# EAGLE design ch55xRebootTool (EAGLE 9.6.2)
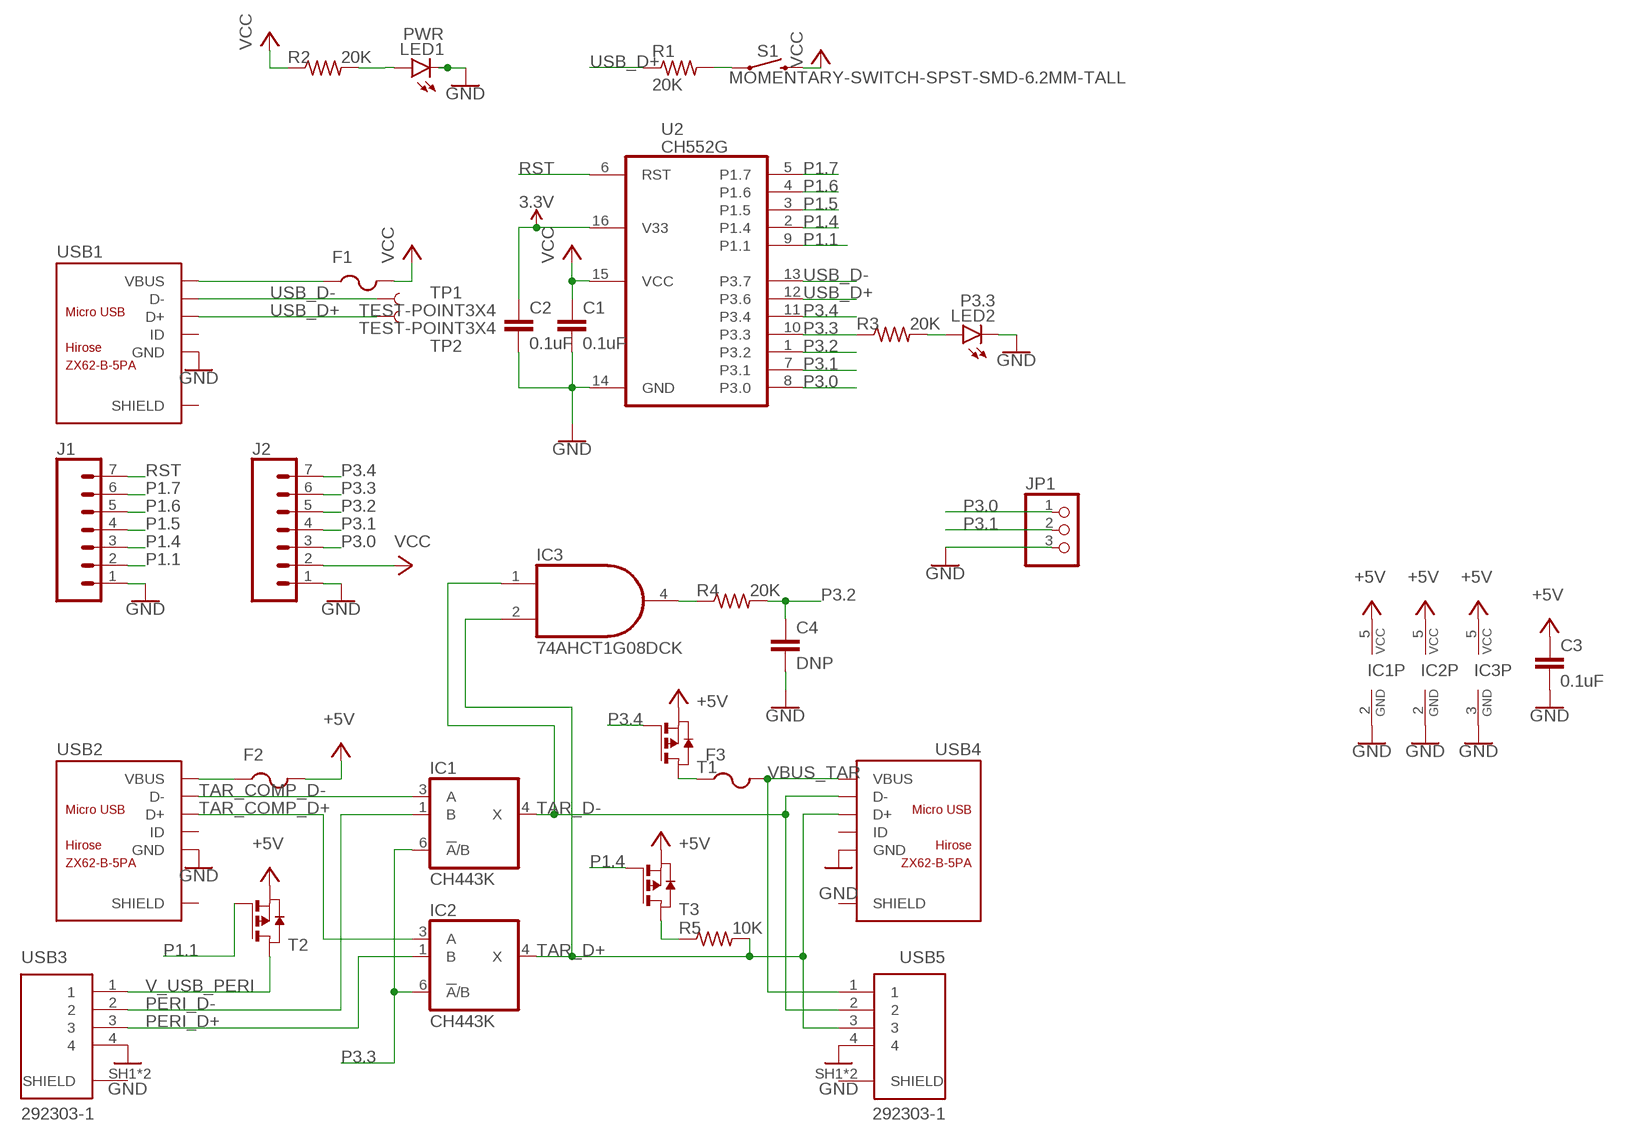
[diagram p0: schematic, sheet 1]

## Parts
C1  0.1uF  C-EUC0805K  [C0805K]
C2  0.1uF  C-EUC0805K  [C0805K]
C3  0.1uF  C-EUC0805K  [C0805K]
C4  DNP  C-EUC0805K  [C0805K]
F1  PTCFUSE-1206  [R1206]
F2  PTCFUSE-1206  [R1206]
F3  PTCFUSE-1206  [R1206]
IC1  CH443K  741G3157DCKR  [DCK_R-PDSO-G6]
IC2  CH443K  741G3157DCKR  [DCK_R-PDSO-G6]
IC3  74AHCT1G08DCK  [SC70-5]
J1  CONN_07NO_SILK  [1X07_NO_SILK]
J2  CONN_07NO_SILK  [1X07_NO_SILK]
JP1  PINHD-1X3  [1X03]
LED1  PWR  GHI-BASICCOMPONENTS_LED-(INCH)-0805  [GHI-BASICCOMPONENTS_0805-LED]
LED2  P3.3  GHI-BASICCOMPONENTS_LED-(INCH)-0805  [GHI-BASICCOMPONENTS_0805-LED]
R1  20K  R-US_R0805  [R0805]
R2  20K  R-US_R0805  [R0805]
R3  20K  R-US_R0805  [R0805]
R4  20K  R-US_R0805  [R0805]
R5  10K  R-US_R0805  [R0805]
S1  MOMENTARY-SWITCH-SPST-SMD-6.2MM-TALL  [TACTILE_SWITCH_SMD_6.2MM_TALL]
T1  PMOSSOT23  [SOT-23]
T2  PMOSSOT23  [SOT-23]
T3  PMOSSOT23  [SOT-23]
TP1  TEST-POINT3X4  [PAD.03X.04]
TP2  TEST-POINT3X4  [PAD.03X.04]
U2  CH552G  MY_IC_CH551G_CH552GSOP-16  [MY_IC_SO16]
USB1  ZX62-B-5PA  MICRO-USB-SMD(ZX62-B-5PA)  [MICRO-USB5+6P-SMD-0.65-AB]
USB2  ZX62-B-5PA  MICRO-USB-SMD(ZX62-B-5PA)  [MICRO-USB5+6P-SMD-0.65-AB]
USB3  292303-1  [292303-1]
USB4  ZX62-B-5PA  MICRO-USB-SMD(ZX62-B-5PA)  [MICRO-USB5+6P-SMD-0.65-AB]
USB5  292303-1  [292303-1]

## Nets
3.3V: C2.1 U2.16(V33)
+5V: C3.1 F2.2 IC1.5(VCC) IC2.5(VCC) IC3.5(VCC) T1.2(S) T2.2(S) T3.2(S)
GND: C1.2 C2.2 C3.2 C4.2 IC1.2(GND) IC2.2(GND) IC3.3(GND) J1.1 J2.1 JP1.3 LED1.K LED2.K U2.14(GND) USB1.5(GND) USB2.5(GND) USB3.4 USB4.5(GND) USB5.4
N$1: R1.2 S1.A2
N$2: LED2.A R3.2
N$3: LED1.A R2.2
N$4: IC3.4(O) R4.1
N$5: F3.1 T1.1(D)
N$7: R5.1 T3.1(D)
P1.1: J1.2 T2.3(G) U2.9(P1.1)
P1.4: J1.3 T3.3(G) U2.2(P1.4)
P1.5: J1.4 U2.3(P1.5)
P1.6: J1.5 U2.4(P1.6)
P1.7: J1.6 U2.5(P1.7)
P3.0: J2.3 JP1.1 U2.8(P3.0)
P3.1: J2.4 JP1.2 U2.7(P3.1)
P3.2: C4.1 J2.5 R4.2 U2.1(P3.2)
P3.3: IC1.6(!A!/B) IC2.6(!A!/B) J2.6 R3.1 U2.10(P3.3)
P3.4: J2.7 T1.3(G) U2.11(P3.4)
PERI_D+: IC2.1(B) USB3.3
PERI_D-: IC1.1(B) USB3.2
RST: J1.7 U2.6(RST)
TAR_COMP_D+: IC2.3(A) USB2.3(D+)
TAR_COMP_D-: IC1.3(A) USB2.2(D-)
TAR_D+: IC2.4(X) IC3.2(I1) R5.2 USB4.3(D+) USB5.3
TAR_D-: IC1.4(X) IC3.1(I0) USB4.2(D-) USB5.2
USB_D+: R1.1 TP2.P$1 U2.12(P3.6) USB1.3(D+)
USB_D-: TP1.P$1 U2.13(P3.7) USB1.2(D-)
V_USB_PERI: T2.1(D) USB3.1
VBUS: F1.1 USB1.1(VBUS)
VBUS_COMP: F2.1 USB2.1(VBUS)
VBUS_TAR: F3.2 USB4.1(VBUS) USB5.1
VCC: C1.1 F1.2 J2.2 R2.1 S1.B2 U2.15(VCC)
Unconnected: USB1.4(ID) USB1.P1(SHIELD) USB1.P2(SHIELD) USB1.P3(SHIELD) USB1.P4(SHIELD) USB1.P5(SHIELD) USB1.P6(SHIELD) USB2.4(ID) USB2.P1(SHIELD) USB2.P2(SHIELD) USB2.P3(SHIELD) USB2.P4(SHIELD) USB2.P5(SHIELD) USB2.P6(SHIELD) USB4.4(ID) USB4.P1(SHIELD) USB4.P2(SHIELD) USB4.P3(SHIELD) USB4.P4(SHIELD) USB4.P5(SHIELD) USB4.P6(SHIELD)

## Power pins joined to a net without a drawn wire
SHIELD: USB3.SH1(SHIELD) USB3.SH2(SHIELD) USB5.SH1(SHIELD) USB5.SH2(SHIELD)

## Library data of the parts
C1-C3 = rcl:C-EU: CAPACITOR, European symbol; LCSC: C16834; SPICEPREFIX: C
C4 = rcl:C-EU: CAPACITOR, European symbol; SPICEPREFIX: C
F1-F3 = adafruit:PTCFUSE: PTC fuses, resettable thermistors; LCSC: C151162
IC1 IC2 = 74xx-little-de:74*1G3157: Single-Pole, Double-Throw Analog Switch Source: http://focus.ti.com/lit/ds/symlink/sn74lvc1g3157.pdf; LCSC: C125185
IC3 = 74xx-little-us:74*1G08: 2-input AND gate; LCSC: C12493
J1 J2 = SparkFun-Connectors:CONN_07: Multi connection point. Often used as Generic Header-pin footprint for 0.1 inch spaced/style header connections On any of the 0.1 inch spaced packages, you can populate with these: Break Away Headers - Straight <https://www.sparkfun.com/products/116> (PRT-00116) Break Away Male Headers - Right Angle <https://www.sparkfun.com/products/553> (PRT-00553) Female Headers <https://www.sparkfun.com/products/115> (PRT-00115) Break Away Headers - Machine Pin <https://www.sparkfun.com/products/117> (PRT-00117) Break Away Female Headers - Swiss Machine Pin <https://www.sparkfun.com/products/743> (PRT-00743) For SCREWTERMINALS and SPRING TERMINALS visit here: Screw Terimnals on SparkFun.com <https://www.sparkfun.com/search/results?term=Screw+Terminals> (5mm/3.5mm/2.54mm spacing) This device is also useful as a general connection point to wire up your design to another part of your project. Our various solder wires solder well into these plated through hole pads. Hook-Up Wire - Assortment (Stranded, 22 AWG) <https://www.sparkfun.com/products/11375> (PRT-11375) Hook-Up Wire - Assortment (Solid Core, 22 AWG) <https://www.sparkfun.com/products/11367> (PRT-11367) View the entire wire category on our website here <https://www.sparkfun.com/categories/141> Special notes: Molex polarized connector foot print use with SKU : PRT-08231 with associated crimp pins and housings. 1MM SMD Version SKU: PRT-10208 NOTES ON THE VARIANTS LOCK and LOCK_LONGPADS... This footprint was designed to help hold the alignment of a through-hole component (i.e. 6-pin header) while soldering it into place. You may notice that each hole has been shifted either up or down by 0.005 of an inch from it's more standard position (which is a perfectly straight line). This slight alteration caused the pins (the squares in the middle) to touch the edges of the holes. Because they are alternating, it causes a "brace" to hold the component in place. 0.005 has proven to be the perfect amount of "off-center" position when using our standard breakaway headers. Although looks a little odd when you look at the bare footprint, once you have a header in there, the alteration is very hard to notice. Also,if you push a header all the way into place, it is covered up entirely on the bottom side.
JP1 = pinhead:PINHD-1X3: PIN HEADER
LED1 LED2 = BeagleBone_Black_Wireless:GHI-BASICCOMPONENTS_LED-(INCH)-
R1-R5 = rcl:R-US_: RESISTOR, American symbol; SPICEPREFIX: R
S1 = SparkFun-Switches:MOMENTARY-SWITCH-SPST: Momentary Switch (Pushbutton) - SPST Normally-open (NO) SPST momentary switches (buttons, pushbuttons). Variants PTH-12MM - 12mm square, through-hole Momentary Pushbutton Switch - 12mm Square <https://www.sparkfun.com/products/9190> (COM-09190) PTH-6.0MM, PTH-6.0MM-KIT - 6.0mm square, through-hole Mini Pushbutton Switch <https://www.sparkfun.com/products/97> (COM-00097) KIT package intended for soldering kit's - only one side of pads' copper is exposed. PTH-RIGHT-ANGLE-KIT - Right-angle, through-hole Right Angle Tactile Button <https://www.sparkfun.com/products/10791> - Used on SparkFun BigTime Watch Kit <https://www.sparkfun.com/products/11734> SMD-12MM - 12mm square, surface-mount Tactile Button - SMD (12mm) <https://www.sparkfun.com/products/12993> (COM-12993) Used on SparkFun PicoBoard <https://www.sparkfun.com/products/11888> SMD-4.5MM - 4.5mm Square Trackball Switch Used on SparkFun Blackberry Trackballer Breakout <https://www.sparkfun.com/products/13169> SMD-4.6MMX2.8MM - 4.60mm x 2.80mm, surface mount Used on SparkFun SAMD21 Mini Breakout <https://www.sparkfun.com/products/13664> SMD-5.2MM, SMD-5.2-REDUNDANT - 5.2mm square, surface-mount Mini Pushbutton Switch - SMD <https://www.sparkfun.com/products/8720> (COM-08720) Used on Arduino Pro Mini <https://www.sparkfun.com/products/11114> REDUNDANT package connects both switch circuits together SMD-6.0X3.5MM - 6.0 x 3.5mm, surface mount Momentary Reset Switch SMD <https://www.sparkfun.com/products/8229> (COM-08229) SMD-6.2MM-TALL - 6.2mm square, surface mount Tactile Button - SMD (6mm) <https://www.sparkfun.com/products/12992> Used on SparkFun Digital Sandbox <https://www.sparkfun.com/products/12651> SMD-RIGHT-ANGLE - Right-angle, surface mount Used on SparkFun Block for Intel® Edison - Arduino <https://www.sparkfun.com/products/13036>; PROD_ID: SWCH-11966; SF_SKU: COM-12992
T1-T3 = zetex:PMOSSOT23: MOS FET; OC_FARNELL: unknown; OC_NEWARK: unknown
TP1 TP2 = SparkFun-Connectors:TEST-POINT: SparkFun Test Points Bare copper test points for troubleshooting or In-Circuit-Testing. These are used by our Production team for verifying production board runs using pogo-pins on test beds. SparkFun Products: SparkFun LSM9DS1 Breakout <https://www.sparkfun.com/products/13284> SparkFun PSOC <https://www.sparkfun.com/products/13714> SparkFun Load Cell Amplifier <https://www.sparkfun.com/products/13879>
U2 = myOwnLib:MY_IC_CH551G_CH552G; LCSC: C111292
USB1 USB2 USB4 = microusbConnector:MICRO-USB-SMD(ZX62-B-5PA): 320010005; LCSC: C10418; MPN: ZX62-B-5PA
USB3 USB5 = USB connector:292303-1: CONN RCPT USB2.0 TYPEA 4POS R/A Manufacturer's datasheet <https://www.te.com/commerce/DocumentDelivery/DDEController?Action=srchrtrv&DocNm=292303&DocType=Customer+Drawing&DocLang=English>; CREATED_BY: PCBLayout.com; DIGIKEY_PARTNO: A31726-ND; LCSC: C2345; MANUFACTURER: TE Connectivity AMP Connectors; MPN: 292303-1

## Board
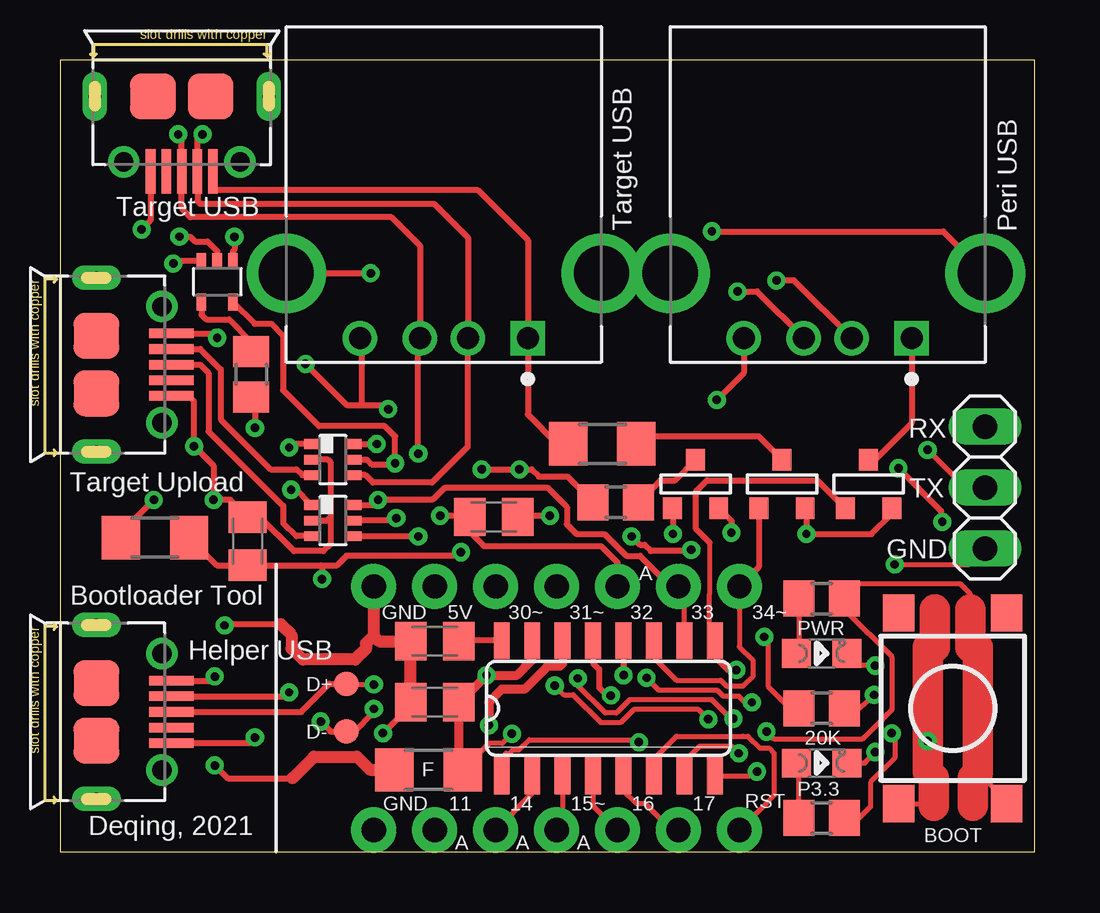
[diagram p1: board, top side]
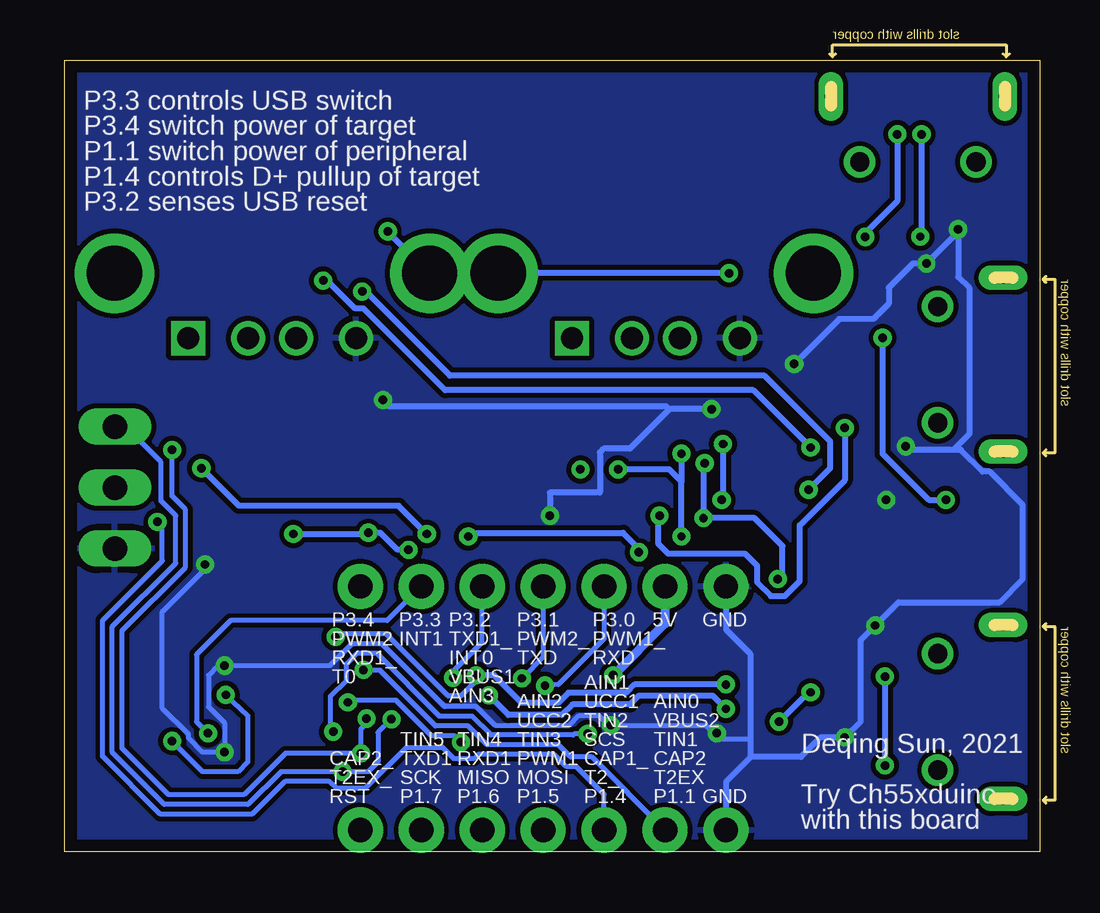
[diagram p2: board, bottom side, seen from below]

Size 40.64 x 33.02 mm. Coordinates in mm from the lower left corner, seen from the top.
Outline: 0,0 40.64,0 40.64,33.02 0,33.02 0,0
Copper layers (1*16): Top 0.035mm / dielectric 1.5mm / Bottom 0.035mm
Design rules "eagleRules10Mil *": minimum track width 8mil, minimum drill 0.3mm, track to track 8mil, track to pad 8mil, pad to pad 8mil, via to via 8mil, smd to smd 8mil, copper to edge 20mil, drill to drill 20mil, minimum pad ring 10mil, minimum via ring 8mil, stop-mask expansion 4mil, vias tented up to drill 14mil, thermal gap 10mil

### Footprints (pad centres in the part's own frame; a part is rotated, then mirrored left to right if it is on the bottom)
C0805K = smd 1.3 x 1.6: 1 -1,0; 2 1,0
R1206 = smd 1.6 x 1.803: 1 -1.422,0; 2 1.422,0
DCK_R-PDSO-G6 = smd 0.4 x 0.7: 1 -0.65,-0.85; 2 0,-0.85; 3 0.65,-0.85; 4 0.65,0.85; 5 0,0.85; 6 -0.65,0.85
SC70-5 = smd 0.4 x 0.7: 1 -0.65,-0.85; 2 0,-0.85; 3 0.65,-0.85; 4 0.65,0.85; 5 -0.65,0.85
1X07_NO_SILK = drill 1.016 pad 1.88: 1 0,0; 2 2.54,0; 3 5.08,0; 4 7.62,0; 5 10.16,0; 6 12.7,0; 7 15.24,0
1X03 = drill 1.016 long: 1 -2.54,0; 2 0,0; 3 2.54,0
GHI-BASICCOMPONENTS_0805-LED = smd 1.2 x 1.2: A 0,1.05; K 0,-1.05
R0805 = smd 1.3 x 1.5: 1 -0.95,0; 2 0.95,0
TACTILE_SWITCH_SMD_6.2MM_TALL = smd 1.55 x 1.3: A1 -3.975,-2.25; A2 3.975,-2.25; B1 -3.975,2.25; B2 3.975,2.25
SOT-23 = smd 0.787 x 0.889: 1 0.025,-1.016; 2 -0.94,1.016; 3 0.991,1.016
PAD.03X.04 = smd 1.016 x 1.016: P$1 0,0
MY_IC_SO16 = smd 0.66 x 1.524: 1 -4.445,-2.819; 2 -3.175,-2.819; 3 -1.905,-2.819; 4 -0.635,-2.819; 5 0.635,-2.819; 6 1.905,-2.819; 7 3.175,-2.819; 8 4.445,-2.819; 9 4.445,2.819; 10 3.175,2.819; 11 1.905,2.819; 12 0.635,2.819; 13 -0.635,2.819; 14 -1.905,2.819; 15 -3.175,2.819; 16 -4.445,2.819
MICRO-USB5+6P-SMD-0.65-AB = smd 0.4 x 1.858: 1 -1.3,3.129; 2 -0.65,3.129; 3 0,3.129; 4 0.65,3.129; 5 1.3,3.129 | smd 1.9 x 1.9: P1 -1.2,0; P2 1.2,0 | drill 0.508 pad 1.016 long: P3 -3.625,0; P4 3.625,0 | drill 0.8: P5 -2.425,2.73; P6 2.425,2.73
292303-1 = drill 0.92 square: 1 -3.5,2.71 | drill 0.92: 2 -1,2.71; 3 1,2.71; 4 3.5,2.71 | drill 2.3: SH1 -6.57,0; SH2 6.57,0

### Placement (x,y rotation side)
C1  15.62,6.25 180 top
C2  15.62,8.79 180 top
C3  7.82,12.95 90 top
C4  18.08,13.97 0 top
F1  15.37,3.43 0 top
F2  3.96,13.11 0 top
F3  22.61,17.02 180 top
IC1  11.38,16.36 270 top
IC2  11.38,13.82 270 top
IC3  6.55,23.77 180 top
J1  13.08,0.91 0 top
J2  13.08,11.07 0 top
JP1  38.56,15.19 270 top
LED1  31.75,8.28 90 top
LED2  31.75,3.71 90 top
R1  31.75,5.99 0 top
R2  31.75,10.57 180 top
R3  31.75,1.42 180 top
R4  7.98,19.91 270 top
R5  23.16,14.58 180 top
S1  37.21,5.99 270 top
T1  30.12,15.34 180 top
T2  33.73,15.34 180 top
T3  26.52,15.34 180 top
TP1  11.94,5.03 0 top
TP2  11.94,7.01 0 top
U2  22.86,5.99 0 top
USB1  1.52,5.84 270 top
USB2  1.52,20.32 270 top
USB3  32,24.13 180 top
USB4  5.08,31.5 180 top
USB5  16,24.13 180 top

### Tracks (layer width: path | path; a pad name or v marks a point on that pad's centre or on a via)
3.3V
  Top 0.254: U2.16 16.65,8.81 C2.1
+5V  (via drill 0.35)
  Top 0.254: v14.02,13.92 13.92,13.82 IC2.5 | IC3.5 8.11,22.02 8.81,22.02 9.3,21.54 9.3,19.25 10.79,17.75 13.54,17.75 13.97,17.32 v13.97,16.2 13.93,16.16 12.99,16.16 12.8,16.36 IC1.5 | F2.2 6.54,11.95 C3.1 10.87,11.95 | 10.87,11.95 11.55,11.95 11.94,12.34 16.56,12.34 v16.71,12.5 | 10.87,11.95 10.92,11.9 v10.92,11.38 | T1.2 31.11,14.28 v31.11,13.26 33.83,13.26 34.67,14.1 T2.2 | T3.2 27.99,13.79 v27.99,13.31 | v23.82,13.16 24.18,12.8 24.37,12.8 24.63,12.54 26.26,12.54 v26.31,12.6
  Bottom 0.254: v13.97,16.2 14.02,16.15 v14.02,13.92 11.89,13.92 10.72,12.75 10.72,11.58 v10.92,11.38 | v31.11,13.26 28.04,13.26 v27.99,13.31 27.48,13.31 26.77,12.6 v26.31,12.6 | v23.82,13.16 23.67,13.31 17.37,13.31 16.76,12.7 16.76,12.5 v16.71,12.5
GND  (via drill 0.35)
  Top 0.203: v33.98,7.77 33.31,7.77 LED1.K | LED2.K 33.56,3.71 33.98,4.13 v33.98,4.17 | v34.8,11.99 37.9,11.99 JP1.3
  Top 0.254: C1.2 14.62,6.11 v13.46,4.95 | USB1.5 7.89,4.54 v8.13,4.78 | IC2.2 11.12,13.82 11.28,13.97 | 11.28,13.97 11.28,16.26 11.18,16.36 IC1.2 | USB4.5 3.78,26.34 v3.4,25.96 | USB2.5 5.36,19.02 5.59,18.8 v5.59,16.92 6.4,16.1 v6.4,14.68 7.1,14.68 C3.2 8.35,13.95 9.75,12.55 10.97,12.55 11.28,12.85 11.28,13.97 | C4.2 19.14,14.02 v20.42,14.02 | v10.24,20.34 11.94,18.64 12.6,18.64 | v13.68,18.46 13.5,18.64 12.6,18.64 | v4.72,24.54 4.81,24.62 IC3.3 | 9.2,9.49 6.9,9.49 v6.86,9.45 | USB3.4 28.5,19.97 v27.38,18.85 | USB5.4 12.6,21.32 12.6,18.64
  Top 0.381: v17.88,5.28 17.88,6.25 18.41,6.78 19.36,6.78 20.32,7.75 20.83,7.75 20.95,7.87 U2.14
  Top 0.508: C1.2 C2.2 13.31,8.79 13.08,9.02 | J2.1 13.08,9.02 | 13.08,9.02 12.76,8.69 12.76,8.47 12.31,8.02 10.12,8.02 9.65,8.48 9.65,9.04 9.2,9.49
  Bottom 0.203: 12.06,4.7 13.34,4.7 13.92,5.28 v17.88,5.28 17.98,5.28 18.39,5.69 19.2,5.69 19.61,5.28 22.71,5.28 23.5,6.07 24.81,6.07 27.41,8.68 28.68,8.68 29.59,7.77 v33.98,7.77 34.24,7.77 34.65,7.37 34.65,6.04 33.98,5.38 v33.98,4.17 34.9,4.17 35.49,4.75 35.49,4.91 36.58,6 36.58,10.01 34.75,11.84 34.75,11.99 v34.8,11.99
  Bottom 0.254: J2.1 13.08,9.27 12.06,8.26 12.06,4.7 12.06,3.96 | J1.1 13.08,2.92 12.06,3.94 12.06,3.96 | 12.06,3.96 9.96,3.96 9.14,4.78 v8.13,4.78 7.47,5.44 7.47,8.84 v6.86,9.45 5.89,10.41 1.68,10.41 0.71,11.38 0.71,14.48 2.09,15.86 2.38,15.86 3.29,16.76 3.61,16.76 | 3.61,16.76 2.95,17.42 2.95,23.52 3.4,23.98 v3.4,25.96 3.4,25.86 v4.72,24.54 5.28,24.54 6.3,23.52 6.3,22.86 6.93,22.23 8.36,22.23 v10.24,20.34 | v13.68,18.46 15.44,18.46 | v20.42,14.02 20.42,14.99 18.34,14.99 18.34,16.66 18.19,16.82 17.09,16.82 15.44,18.46 | 15.44,18.46 15.57,18.59 27.13,18.59 v27.38,18.85 | v5.59,16.92 5.44,16.76 3.61,16.76
  pour Bottom: 0,0 40.64,0 40.64,33.02 0,33.02
N$1  (via drill 0.35)
  Top 0.203: R1.2 33.33,5.99 v33.93,6.55 | 36.17,8.53 36.47,8.53 | 36.17,3.34 36.42,3.08 | S1.A2 36.34,2.02 36.42,1.93
  Top 1.27: 36.17,8.53 v36.17,4.62 36.17,3.34 | 36.47,8.53 36.47,10.11 | 36.42,1.93 36.42,3.08
  Bottom 0.203: v33.93,6.55 33.02,5.69 33.02,3.76 33.43,3.35 34.9,3.35 v36.17,4.62
N$2
  Top 0.203: R3.2 30.8,3.61 LED2.A
N$3
  Top 0.203: R2.2 30.8,8.38 LED1.A
N$4
  Top 0.254: IC3.4 5.9,22.39 6.1,22.2 7.05,22.2 7.98,21.27 R4.1
N$5
  Top 0.254: F3.1 24.33,17.32 29.13,17.32 T1.1
N$7
  Top 0.254: R5.1 25.03,15.49 25.63,15.49 T3.1
P1.1  (via drill 0.35)
  Top 0.203: v28.19,7.59 27.82,7.59 27.28,8.13 27.28,8.79 U2.9 27.08,9.04 27.08,10.77 27.08,12.9
  Top 0.254: T2.3 31.57,15.49 26.98,15.49 26.52,15.04 26.52,13.46 27.08,12.9
  Bottom 0.203: J1.2 18.67,3.96 19.56,3.96 20.07,4.47 23.04,4.47 23.83,5.26 25.19,5.26 27.52,7.59 v28.19,7.59
P1.4  (via drill 0.35)
  Top 0.203: U2.2 19.68,2.44 J1.3 | v36.78,13.77 36.73,13.72
  Top 0.254: T3.3 25.55,14.3 v25.55,13.26 | v34.95,16 36.73,14.22 36.73,13.72
  Bottom 0.203: J1.3 18.16,2.41 19.3,3.56 19.73,3.56 20.23,4.06 23.42,4.06 23.59,3.89 24.41,3.89 24.89,4.37 26.4,4.37 28.1,2.67 29.34,2.67 29.62,2.95 31.46,2.95 32.84,1.57 36.66,1.57 39.06,3.98 39.06,9.65 36.58,12.14 36.58,13.56 v36.78,13.77
  Bottom 0.254: v25.55,13.26 26.72,14.43 33.38,14.43 v34.95,16
P1.5
  Top 0.203: U2.3 20.95,1.17 J1.4
P1.6
  Top 0.203: U2.4 22.23,1.93 J1.5
P1.7
  Top 0.203: U2.5 23.5,2.54 24,2.03 24.38,2.03 25.32,1.09 25.6,1.09 J1.6
P3.0  (via drill 0.35)
  Top 0.203: v20.62,6.93 21.01,6.55 21.4,6.55 22.56,5.38 23.36,5.38 23.92,5.94 26.62,5.94 v27.03,5.54 | U2.8 28.88,3.17 v29.06,3.35
  Bottom 0.203: J2.3 18.16,8.89 20.07,6.99 v20.62,6.93 | v27.03,5.54 27.58,4.98 27.58,3.76 27.99,3.35 v29.06,3.35 31.63,3.35 33,1.98 36.49,1.98 38.66,4.15 38.66,9.4 36.02,12.04 36.02,14.02 36.63,14.63 36.63,16.26 38.1,17.73 JP1.1
P3.1  (via drill 0.35)
  Top 0.203: v21.59,7.24 21.59,6.93 22.73,5.79 23.19,5.79 23.75,6.35 27.18,6.35 27.97,5.56 v28.07,5.56 | U2.7 26.04,3.79 26.67,4.42 27.99,4.42 v28.3,4.12 | v36.17,16.76 37.74,15.19 JP1.2
  Bottom 0.203: J2.4 20.7,8.13 v21.59,7.24 | v28.07,5.56 28.07,5.36 28.3,5.13 v28.3,4.12 31.45,4.12 33.17,2.39 36.32,2.39 38.25,4.32 38.25,9.23 35.61,11.87 35.61,12.8 35.61,14.28 36.17,14.83 v36.17,16.76
P3.2  (via drill 0.35)
  Top 0.203: U2.1 18.41,3.94 18.59,4.12 18.75,4.12 18.89,4.25 19.12,4.25 19.56,4.68 24.02,4.68 v24.13,4.58 | v24.45,7.26 24.96,6.76 27.38,6.76 27.64,6.5 28.29,6.5 28.55,6.24 v28.85,6.24
  Top 0.254: R4.2 8.13,18.81 v8.13,17.68 | v15.85,14.02 17.03,14.02 C4.1 17.09,13.34 17.68,12.75 22.55,12.75 23.24,12.06 J2.5
  Bottom 0.203: J2.5 23.24,8.74 24.45,7.52 v24.45,7.26 | v24.13,4.58 24.41,4.85 25.36,4.85 26.85,6.34 28.74,6.34 v28.85,6.24
  Bottom 0.254: v8.13,17.68 8.13,15.49 10.01,13.61 10.01,11.29 10.63,10.67 11.21,10.67 11.79,11.24 11.79,11.94 12.29,12.45 15.49,12.45 15.9,12.85 15.9,13.97 v15.85,14.02
P3.3  (via drill 0.35)
  Top 0.203: U2.10 26.04,10.82 J2.6 | v34.67,4.95 34.8,4.83 34.8,3.91 33.78,2.9 33.78,1.88 33.33,1.42 R3.1
  Top 0.254: IC2.6 13.04,14.47 v13.26,14.68 15.51,14.68 15.56,14.73 15.59,14.73 16.05,15.19 20.32,15.19 21.13,14.38 21.13,13.66 21.54,13.26 22.69,13.26 23.61,12.34 24.18,12.34 25.45,11.07 J2.6 | IC1.6 v13.2,17.01
  Bottom 0.203: J2.6 27.2,9.65 33.73,9.65 35.15,8.23 35.15,5.43 v34.67,4.95
  Bottom 0.254: v13.2,17.01 13.2,14.74 v13.26,14.68
P3.4
  Top 0.203: U2.11 24.77,8.1 25.7,7.16 27.55,7.16 27.8,6.91 27.91,6.91 28.48,6.91 28.88,7.31 28.88,8 28.32,8.56 J2.7
  Top 0.254: J2.7 29.13,11.89 T1.3
PERI_D+  (via drill 0.35)
  Top 0.254: IC2.1 10.48,14.47 9.79,15.15 9.69,15.15 v9.64,15.1 | v28.25,23.37 29.06,23.37 USB3.3
  Bottom 0.254: v9.64,15.1 8.74,16 8.74,17.12 11.48,19.86 24.59,19.86 28.09,23.37 v28.25,23.37
PERI_D-  (via drill 0.35)
  Top 0.254: IC1.1 9.69,17.01 v9.55,16.87 | USB3.2 30.6,23.82 v29.87,23.82
  Bottom 0.254: v9.55,16.87 11.94,19.25 24.79,19.25 28.2,22.66 28.54,22.66 29.7,23.82 v29.87,23.82
RST
  Top 0.203: U2.6 24.77,3.89 25.7,4.83 28.45,4.83 28.68,4.83 29.17,4.33 29.55,4.33 29.77,4.12 29.77,2.36 29.13,1.72 J1.7
SHIELD  (via drill 0.35)
  Top 0.254: USB5.SH2 v12.95,24.13 | v27.18,25.87 36.83,25.87 USB3.SH1 | USB5.SH1 USB3.SH2
  Bottom 0.254: v12.95,24.13 USB5.SH1 | USB3.SH2 v27.18,25.87
TAR_COMP_D+
  Top 0.254: USB2.3 5.84,20.32 6.2,19.96 6.2,17.54 9.31,14.43 9.31,13.7 9.85,13.17 IC2.3
TAR_COMP_D-
  Top 0.254: USB2.2 5.85,20.97 6.71,20.12 6.71,18.03 8.78,15.96 9.86,15.96 10.11,15.71 IC1.3
TAR_D+  (via drill 0.35)
  Top 0.254: v14.94,13.16 12.24,13.16 IC2.4 | v4.93,29.92 4.93,29.82 5.08,29.67 USB4.3 5.08,26.82 5.44,26.47 13.82,26.47 15,25.28 USB5.3 14.94,21.35 v14.94,16.61 | v4.98,25.65 5.44,25.65 5.64,25.45 6.15,25.45 6.55,25.04 IC3.2 | v17.58,15.95 v19.15,15.95 19.66,15.95 19.96,15.65 21.15,15.65 R5.2
  Bottom 0.254: v14.94,16.61 14.94,15.44 | v14.94,13.16 14.94,15.44 | v4.93,29.92 4.93,25.7 v4.98,25.65 | 14.94,15.44 15.44,15.95 v17.58,15.95
TAR_D-  (via drill 0.35)
  Top 0.254: IC1.4 12.74,15.71 13.04,15.4 15.5,15.4 17,16.9 USB5.2 17,25.62 15.6,27.03 5.84,27.03 5.73,27.14 USB4.2 5.73,29.71 v5.94,29.92 | v7.27,25.64 7.27,25.1 7.2,25.03 IC3.1
  Bottom 0.254: v5.94,29.92 5.94,27.13 7.27,25.8 v7.27,25.64
USB_D+  (via drill 0.35)
  Top 0.203: TP2.P$1 11.96,6.99 v13.08,6.99 | v29.36,8.97 29.52,8.81 29.52,6.91 30.43,5.99 R1.1
  Top 0.254: U2.12 v23.5,7.37 | USB1.3 10.06,5.84 11.23,7.01 TP2.P$1
  Bottom 0.203: v23.5,7.37 23.5,7.14 24.13,6.5 24.66,6.5 27.25,9.09 29.24,9.09 v29.36,8.97
  Bottom 0.254: v23.5,7.37 22.75,7.37 21.6,6.22 20.07,6.22 19.65,6.64 17.23,6.64 16.89,6.99 v13.08,6.99
USB_D-  (via drill 0.35)
  Top 0.203: TP1.P$1 12.09,5.03 12.22,5.03 12.26,4.99
  Top 0.254: v13.08,5.97 13.08,5.82 12.26,4.99 | U2.13 22.23,7.87 22.48,7.62 22.48,6.86 22.81,6.53 v22.96,6.53 | USB1.2 9.39,6.49 v9.55,6.66 | v10.87,5.44 11.28,5.03 12.09,5.03
  Bottom 0.254: v13.08,5.97 13.64,6.53 16.7,6.53 17.08,6.15 19.49,6.15 19.93,5.71 22.15,5.71 v22.96,6.53 | v9.55,6.66 9.65,6.66 v10.87,5.44
V_USB_PERI
  Top 0.254: T2.1 33.98,16.36 35.41,17.78 35.5,17.88 USB3.1
VBUS  (via drill 0.35)
  Top 0.254: USB1.1 6.28,7.14 v6.45,7.32 | v6.45,3.61 6.99,3.07 9.7,3.07
  Top 0.508: 9.7,3.07 10.59,3.97 12.38,3.97 12.92,3.43 F1.1
  Bottom 0.254: v6.45,7.32 v6.45,3.61
VBUS_COMP  (via drill 0.35)
  Top 0.254: USB2.1 6.37,21.62 v6.55,21.44 | v3.91,14.68 2.54,13.31 F2.1
  Bottom 0.254: v6.55,21.44 6.55,16.61 4.62,14.68 v3.91,14.68
VBUS_TAR
  Top 0.254: USB4.1 6.38,27.58 17.42,27.58 19.5,25.51 USB5.1 19.5,18.24 20.73,17.02 F3.2
VCC  (via drill 0.35)
  Top 0.203: v18.84,4.93 18.43,4.52 17.88,4.52 F1.2 | v29.45,5.02 29.75,4.72 33.48,4.72 34.7,5.94 34.7,8.13 32.79,10.03 32.79,10.47 R2.1 33.31,11.18 37.54,11.18 37.95,10.77 37.95,10.11 | S1.B2 39.46,2.14 38.25,3.3 38.2,3.35 38.2,3.25 38.05,3.1 | 38.25,8.53 37.95,8.53 | 19.68,8 U2.15
  Top 0.254: 15.62,11.4 J2.2
  Top 0.381: 19.68,8 19.05,7.37 v17.78,7.37 16.66,6.25 C1.1 16.62,3.6 F1.2
  Top 1.27: 38.25,8.53 38.25,3.3 | 37.95,10.11 37.95,8.53 | 38.05,3.1 38.05,1.93
  Bottom 0.203: v18.84,4.93 19.39,4.93 19.44,4.88 22.88,4.88 23.66,5.66 25.02,5.66 27.63,8.27 28.48,8.27 28.91,7.84 28.91,7.16 29.57,6.5 29.57,5.33 29.45,5.22 v29.45,5.02
  Bottom 0.254: J2.2 15.62,11.56
  Bottom 0.381: J2.2 15.62,9.53 v17.78,7.37

### Text on the board
tNames: Target USB | Target USB | Peri USB | RX | Target Upload | TX | GND | A | Bootloader Tool | GND | 5V | 30~ | 31~ | 32 | 33 | 34~ | PWR | Helper USB | D+ | D- | 20K | F | GND | 11 | 14 | 15~ | 16 | 17 | RST | P3.3 | Deqing, 2021 | A | A | A | BOOT
bNames: P3.3 controls USB switch / P3.4 switch power of target / P1.1 switch power of peripheral / P1.4 controls D+ pullup of target / P3.2 senses USB reset | GND | 5V | P3.0 / PWM1_ / RXD | P3.1 / PWM2_ / TXD | P3.2 / TXD1_ / INT0 / VBUS1 / AIN3 | P3.3 / INT1 | P3.4 / PWM2 / RXD1_ / T0 | GND | AIN0 / VBUS2 / TIN1 / CAP2 / T2EX / P1.1 | AIN1 / UCC1 / TIN2 / SCS / CAP1_ / T2_ / P1.4 | AIN2 / UCC2 / TIN3 / PWM1 / MOSI / P1.5 | TIN4 / RXD1 / MISO / P1.6 | TIN5 / TXD1 / SCK / P1.7 | CAP2_ / T2EX_ / RST | Deqing Sun, 2021 / / Try Ch55xduino / with this board